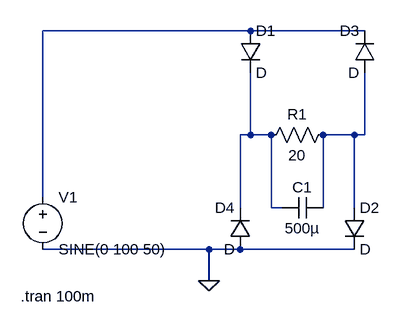
[diagram p0: schematic Draft1.asc]
Draft1.asc, the LTspice schematic file:
Version 4
SHEET 1 880 680
WIRE 384 -112 64 -112
WIRE 560 -112 384 -112
WIRE 384 48 384 -48
WIRE 384 48 368 48
WIRE 416 48 384 48
WIRE 544 48 496 48
WIRE 560 48 560 -48
WIRE 560 48 544 48
WIRE 64 144 64 -112
WIRE 368 160 368 48
WIRE 416 160 416 48
WIRE 432 160 416 160
WIRE 496 160 496 48
WIRE 544 160 544 48
WIRE 320 224 64 224
WIRE 368 224 320 224
WIRE 544 224 368 224
WIRE 320 272 320 224
FLAG 320 272 0
SYMBOL voltage 64 128 R0
WINDOW 123 0 0 Left 0
WINDOW 39 0 0 Left 0
SYMATTR InstName V1
SYMATTR Value SINE(0 100 50)
SYMBOL res 512 32 R90
WINDOW 0 0 56 VBottom 2
WINDOW 3 32 56 VTop 2
SYMATTR InstName R1
SYMATTR Value 20
SYMBOL diode 368 -112 R0
SYMATTR InstName D1
SYMBOL diode 528 160 R0
SYMATTR InstName D2
SYMBOL diode 576 -48 R180
WINDOW 0 24 64 Left 2
WINDOW 3 24 0 Left 2
SYMATTR InstName D3
SYMBOL diode 384 224 R180
WINDOW 0 24 64 Left 2
WINDOW 3 24 0 Left 2
SYMATTR InstName D4
SYMBOL cap 496 144 R90
WINDOW 0 0 32 VBottom 2
WINDOW 3 32 32 VTop 2
SYMATTR InstName C1
SYMATTR Value 500µ
TEXT 30 296 Left 2 !.tran 100m

The netlist it stands for:
* Draft1.asc
V1 N001 0 SINE(0 100 50)
R1 N003 N002 20
D1 N001 N002 D
D2 N003 0 D
D3 N003 N001 D
D4 0 N002 D
C1 N003 N002 500µ
.model D D
.lib standard.dio
.tran 100m
.backanno
.end